# EAGLE design shed (EAGLE 9.5.2)
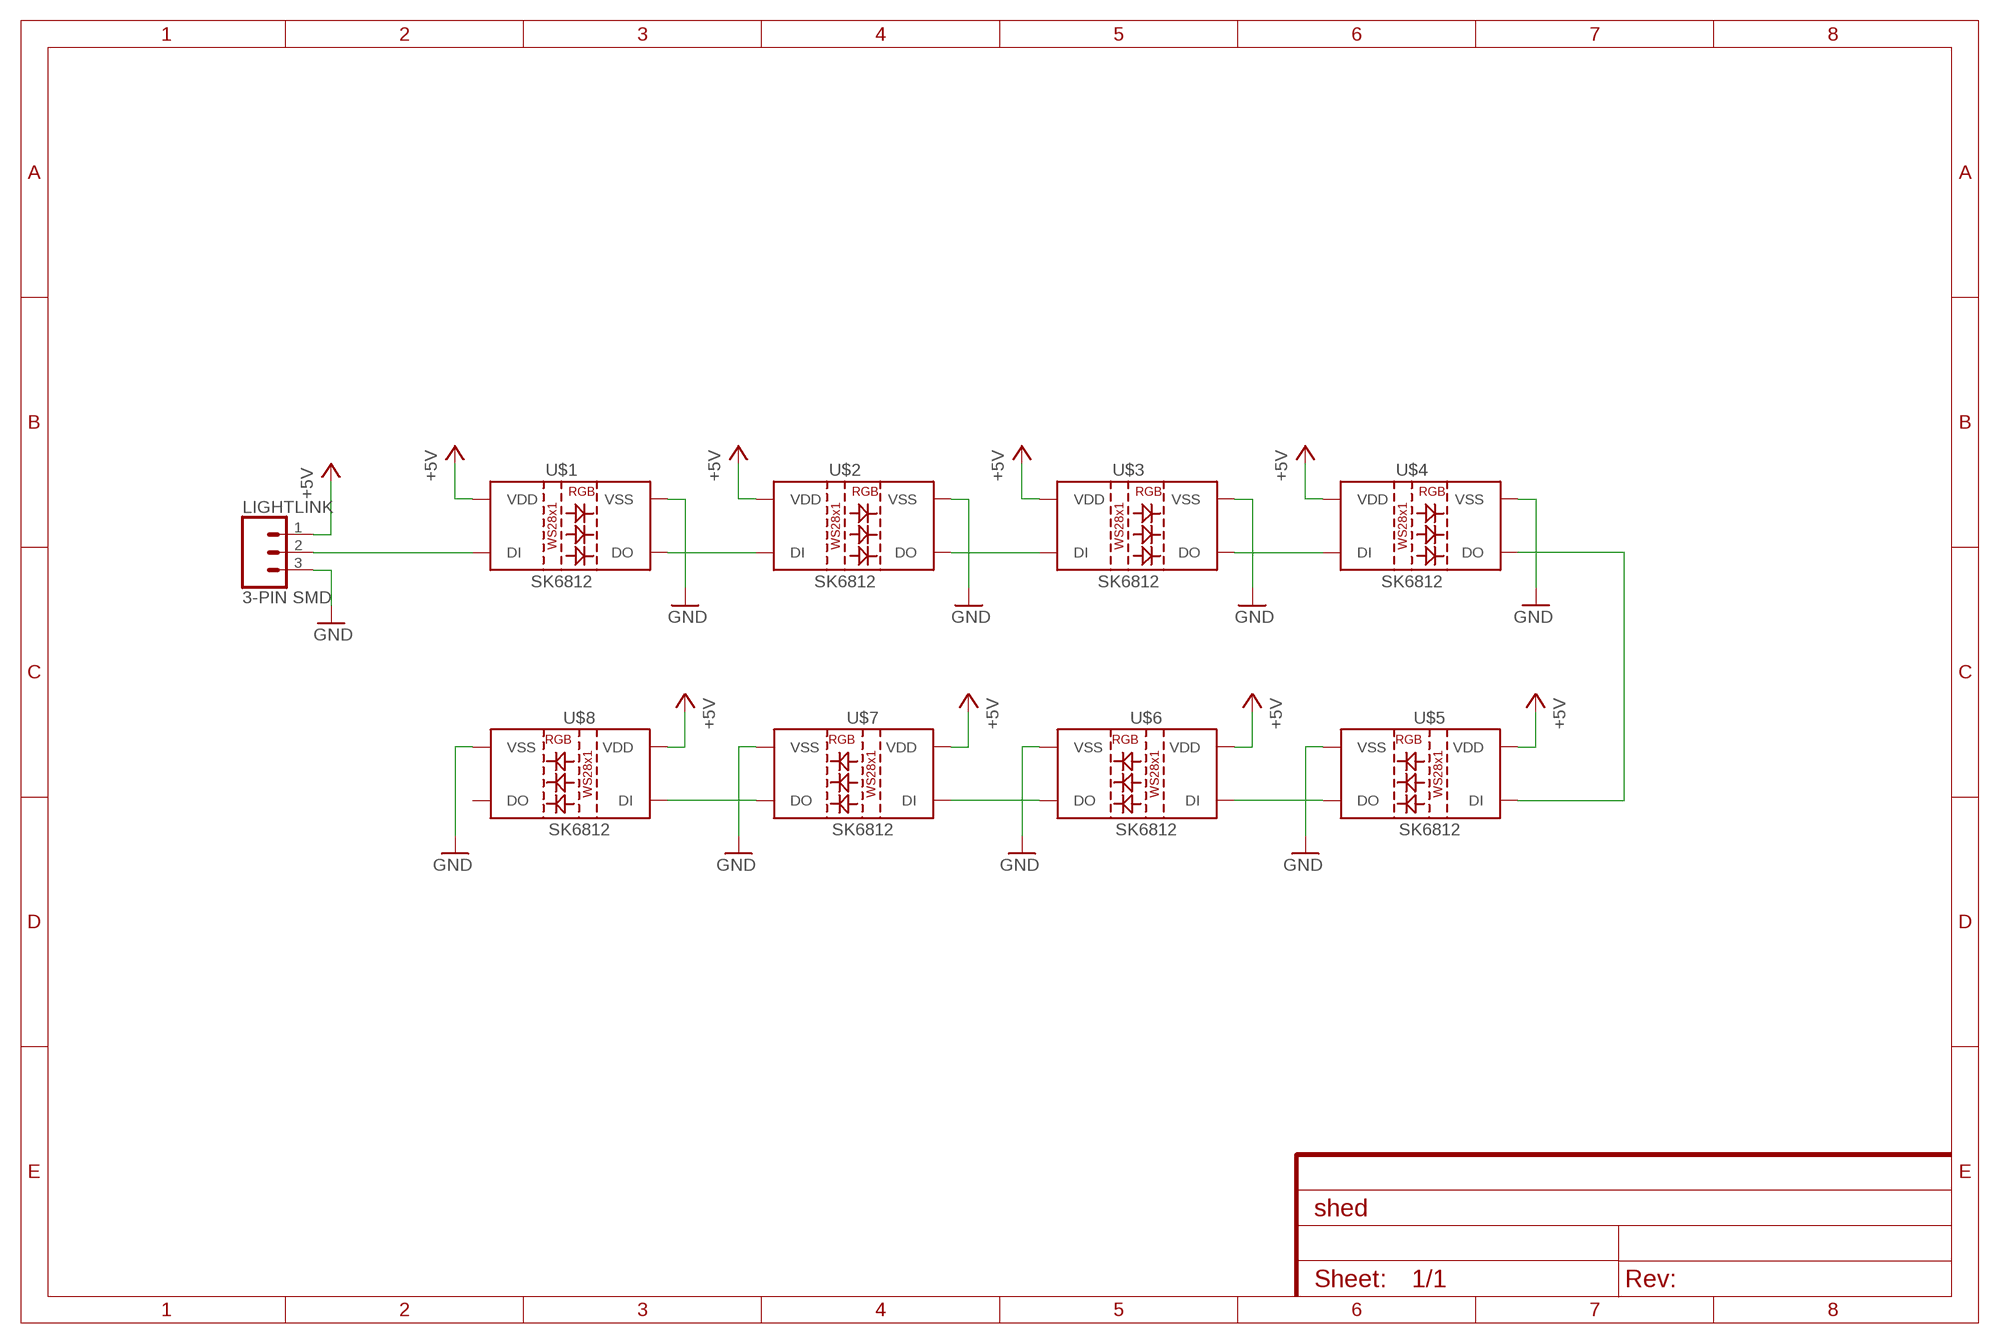
[diagram p0: schematic, sheet 1]

## Parts
LIGHTLINK  3-PIN SMD  CONN_03JST-SMD  [JST-3-SMD]
U$1  SK6812  [LED3535]
U$2  SK6812  [LED3535]
U$3  SK6812  [LED3535]
U$4  SK6812  [LED3535]
U$5  SK6812  [LED3535]
U$6  SK6812  [LED3535]
U$7  SK6812  [LED3535]
U$8  SK6812  [LED3535]

## Nets
+5V: LIGHTLINK.1 U$1.3(VDD) U$2.3(VDD) U$3.3(VDD) U$4.3(VDD) U$5.3(VDD) U$6.3(VDD) U$7.3(VDD) U$8.3(VDD)
GND: LIGHTLINK.3 U$1.1(VSS) U$2.1(VSS) U$3.1(VSS) U$4.1(VSS) U$5.1(VSS) U$6.1(VSS) U$7.1(VSS) U$8.1(VSS)
N$1: U$2.4(DO) U$3.2(DI)
N$2: U$3.4(DO) U$4.2(DI)
N$3: U$1.4(DO) U$2.2(DI)
N$4: LIGHTLINK.2 U$1.2(DI)
N$5: U$5.4(DO) U$6.2(DI)
N$6: U$4.4(DO) U$5.2(DI)
N$7: U$6.4(DO) U$7.2(DI)
N$8: U$7.4(DO) U$8.2(DI)
Unconnected: U$8.4(DO)

## Library data of the parts
LIGHTLINK = SparkFun-Connectors:CONN_03: Multi connection point. Often used as Generic Header-pin footprint for 0.1 inch spaced/style header connections On any of the 0.1 inch spaced packages, you can populate with these: Break Away Headers - Straight <https://www.sparkfun.com/products/116> (PRT-00116) Break Away Male Headers - Right Angle <https://www.sparkfun.com/products/553> (PRT-00553) Female Headers <https://www.sparkfun.com/products/115> (PRT-00115) Break Away Headers - Machine Pin <https://www.sparkfun.com/products/117> (PRT-00117) Break Away Female Headers - Swiss Machine Pin <https://www.sparkfun.com/products/743> (PRT-00743) Stackable Header - 3 Pin (Female, 0.1") <https://www.sparkfun.com/products/13875> (PRT-13875) For SCREWTERMINALS and SPRING TERMINALS visit here: Screw Terimnals on SparkFun.com <https://www.sparkfun.com/search/results?term=Screw+Terminals> (5mm/3.5mm/2.54mm spacing) This device is also useful as a general connection point to wire up your design to another part of your project. Our various solder wires solder well into these plated through hole pads. Hook-Up Wire - Assortment (Stranded, 22 AWG) <https://www.sparkfun.com/products/11375> (PRT-11375) Hook-Up Wire - Assortment (Solid Core, 22 AWG) <https://www.sparkfun.com/products/11367> (PRT-11367) View the entire wire category on our website here <https://www.sparkfun.com/categories/141> Special notes: Molex polarized connector foot print use with SKU : PRT-08232 with associated crimp pins and housings.; PROD_ID: CONN-12591
U$1-U$8 = gone:SK6812

## Board
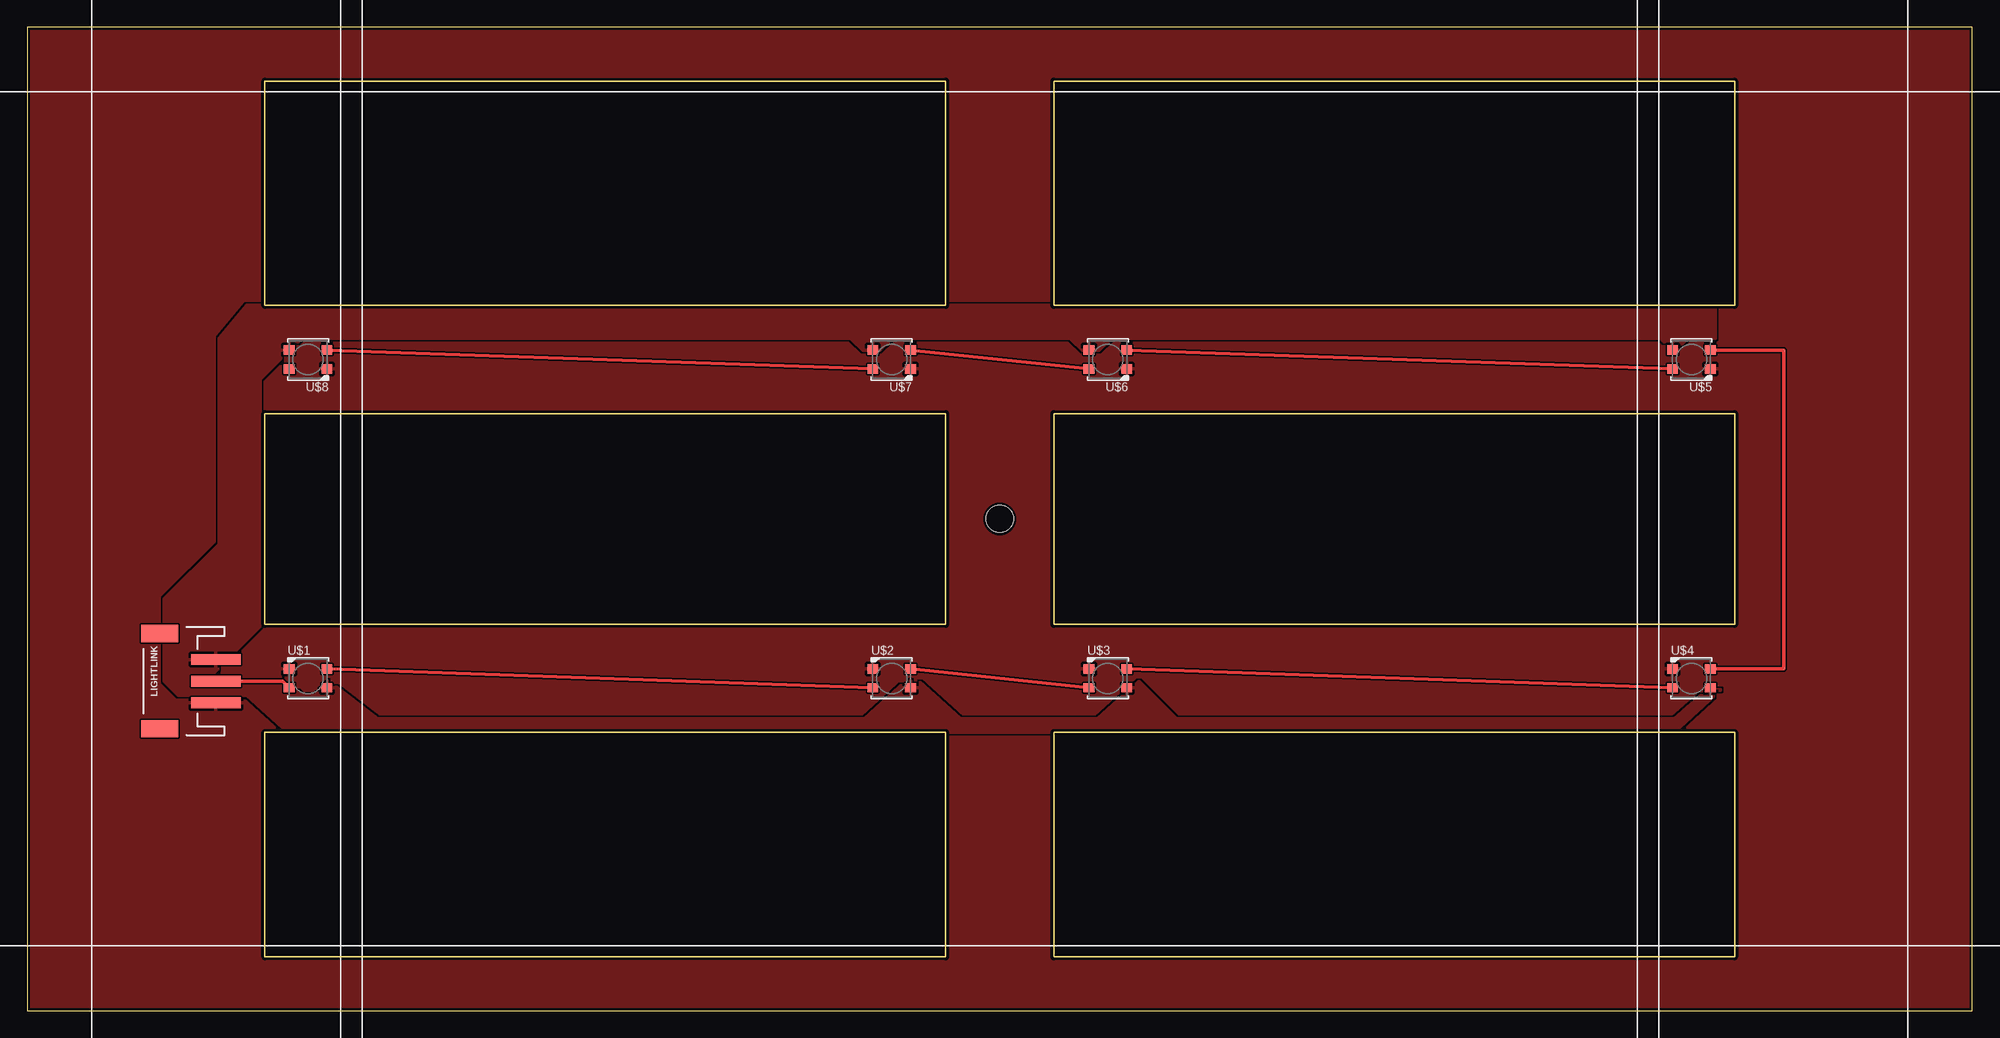
[diagram p1: board, top side]

Size 180 x 91 mm. Coordinates in mm from the lower left corner, seen from the top.
Outline: 0,0 180,0 180,91 0,91 0,0
Outline: 22,55.25 85,55.25 85,35.75 22,35.75 22,55.25
Outline: 95,55.25 158,55.25 158,35.75 95,35.75 95,55.25
Outline: 95,86 158,86 158,65.25 95,65.25 95,86
Outline: 22,86 85,86 85,65.25 22,65.25 22,86
Outline: 22,25.75 85,25.75 85,5 22,5 22,25.75
Outline: 95,25.75 158,25.75 158,5 95,5 95,25.75
Copper layers (1*16): Top 0.035mm / dielectric 1.5mm / Bottom 0.035mm
Design rules "dirtypcbs": minimum track width 6mil, minimum drill 12mil, track to track 6mil, track to pad 6mil, pad to pad 6mil, via to via 6mil, smd to smd 0mil, copper to edge 10mil, drill to drill 10mil, minimum pad ring 10mil, minimum via ring 6mil, stop-mask expansion 2mil, vias tented up to drill 25mil, thermal gap 10mil
Holes 2.5 mm at 90,45.5

### Footprints (pad centres in the part's own frame; a part is rotated, then mirrored left to right if it is on the bottom)
JST-3-SMD = smd 1 x 4.6: 1 2.01,-4.77; 2 0.01,-4.77; 3 -1.99,-4.77 | smd 1.6 x 3.4: NC1 -4.39,0.43; NC2 4.41,0.43
LED3535 = smd 1 x 0.85: 1 -1.75,0.875; 2 -1.75,-0.875; 3 1.75,-0.875; 4 1.75,0.875

### Placement (x,y rotation side)
LIGHTLINK  12.7,30.48 90 top
U$1  26,30.75 0 top
U$2  80,30.75 0 top
U$3  100,30.75 0 top
U$4  154,30.75 0 top
U$5  154,60.25 180 top
U$6  100,60.25 180 top
U$7  80,60.25 180 top
U$8  26,60.25 180 top

### Tracks (layer width: path | path; a pad name or v marks a point on that pad's centre or on a via)
+5V
  pour Top: 152.4,25.75 24.13,25.75 20.32,29.21 13.97,29.21 12.7,30.48 12.7,38.1 17.78,43.18 17.78,62.23 20.32,65.25 156.21,65.25 156.21,62.23 153.67,62.23 152.4,60.96 151.13,62.23 100.33,62.23 99.06,60.96 97.79,60.96 96.52,62.23 80.01,62.23 78.74,60.96 77.47,60.96 76.2,62.23 25.4,62.23 21.59,58.42 21.59,35.56 16.51,30.48 24.13,30.48 25.4,29.21 26.67,29.21 27.94,30.48 32.42,27 77.47,27 81.28,30.48 82.55,30.48 86.36,27 99.06,27 102.87,30.48 106.35,27 152.4,27 155.45,29.72 156.72,29.72
GND
  pour Top (rank 6): -2.5,93.5 182.5,93.5 182.5,-2.5 -2.5,-2.5
N$1
  Top 0.305: U$2.4 U$3.2
N$2
  Top 0.305: U$3.4 U$4.2
N$3
  Top 0.305: U$1.4 U$2.2
N$4
  Top 0.305: LIGHTLINK.2 23.64,30.49 U$1.2
N$5
  Top 0.305: U$6.2 U$5.4
N$6
  Top 0.305: U$4.4 162.56,31.62 162.56,61.12 U$5.2
N$7
  Top 0.305: U$7.2 U$6.4
N$8
  Top 0.305: U$8.2 U$7.4